# Altium schematic sheet DDR3_PLEIADES.SchDoc
size Tabloid; SheetNumber: 1; SheetTotal: 1; Sheet_Name: Insert name in Document Parameters; Size: 11x17
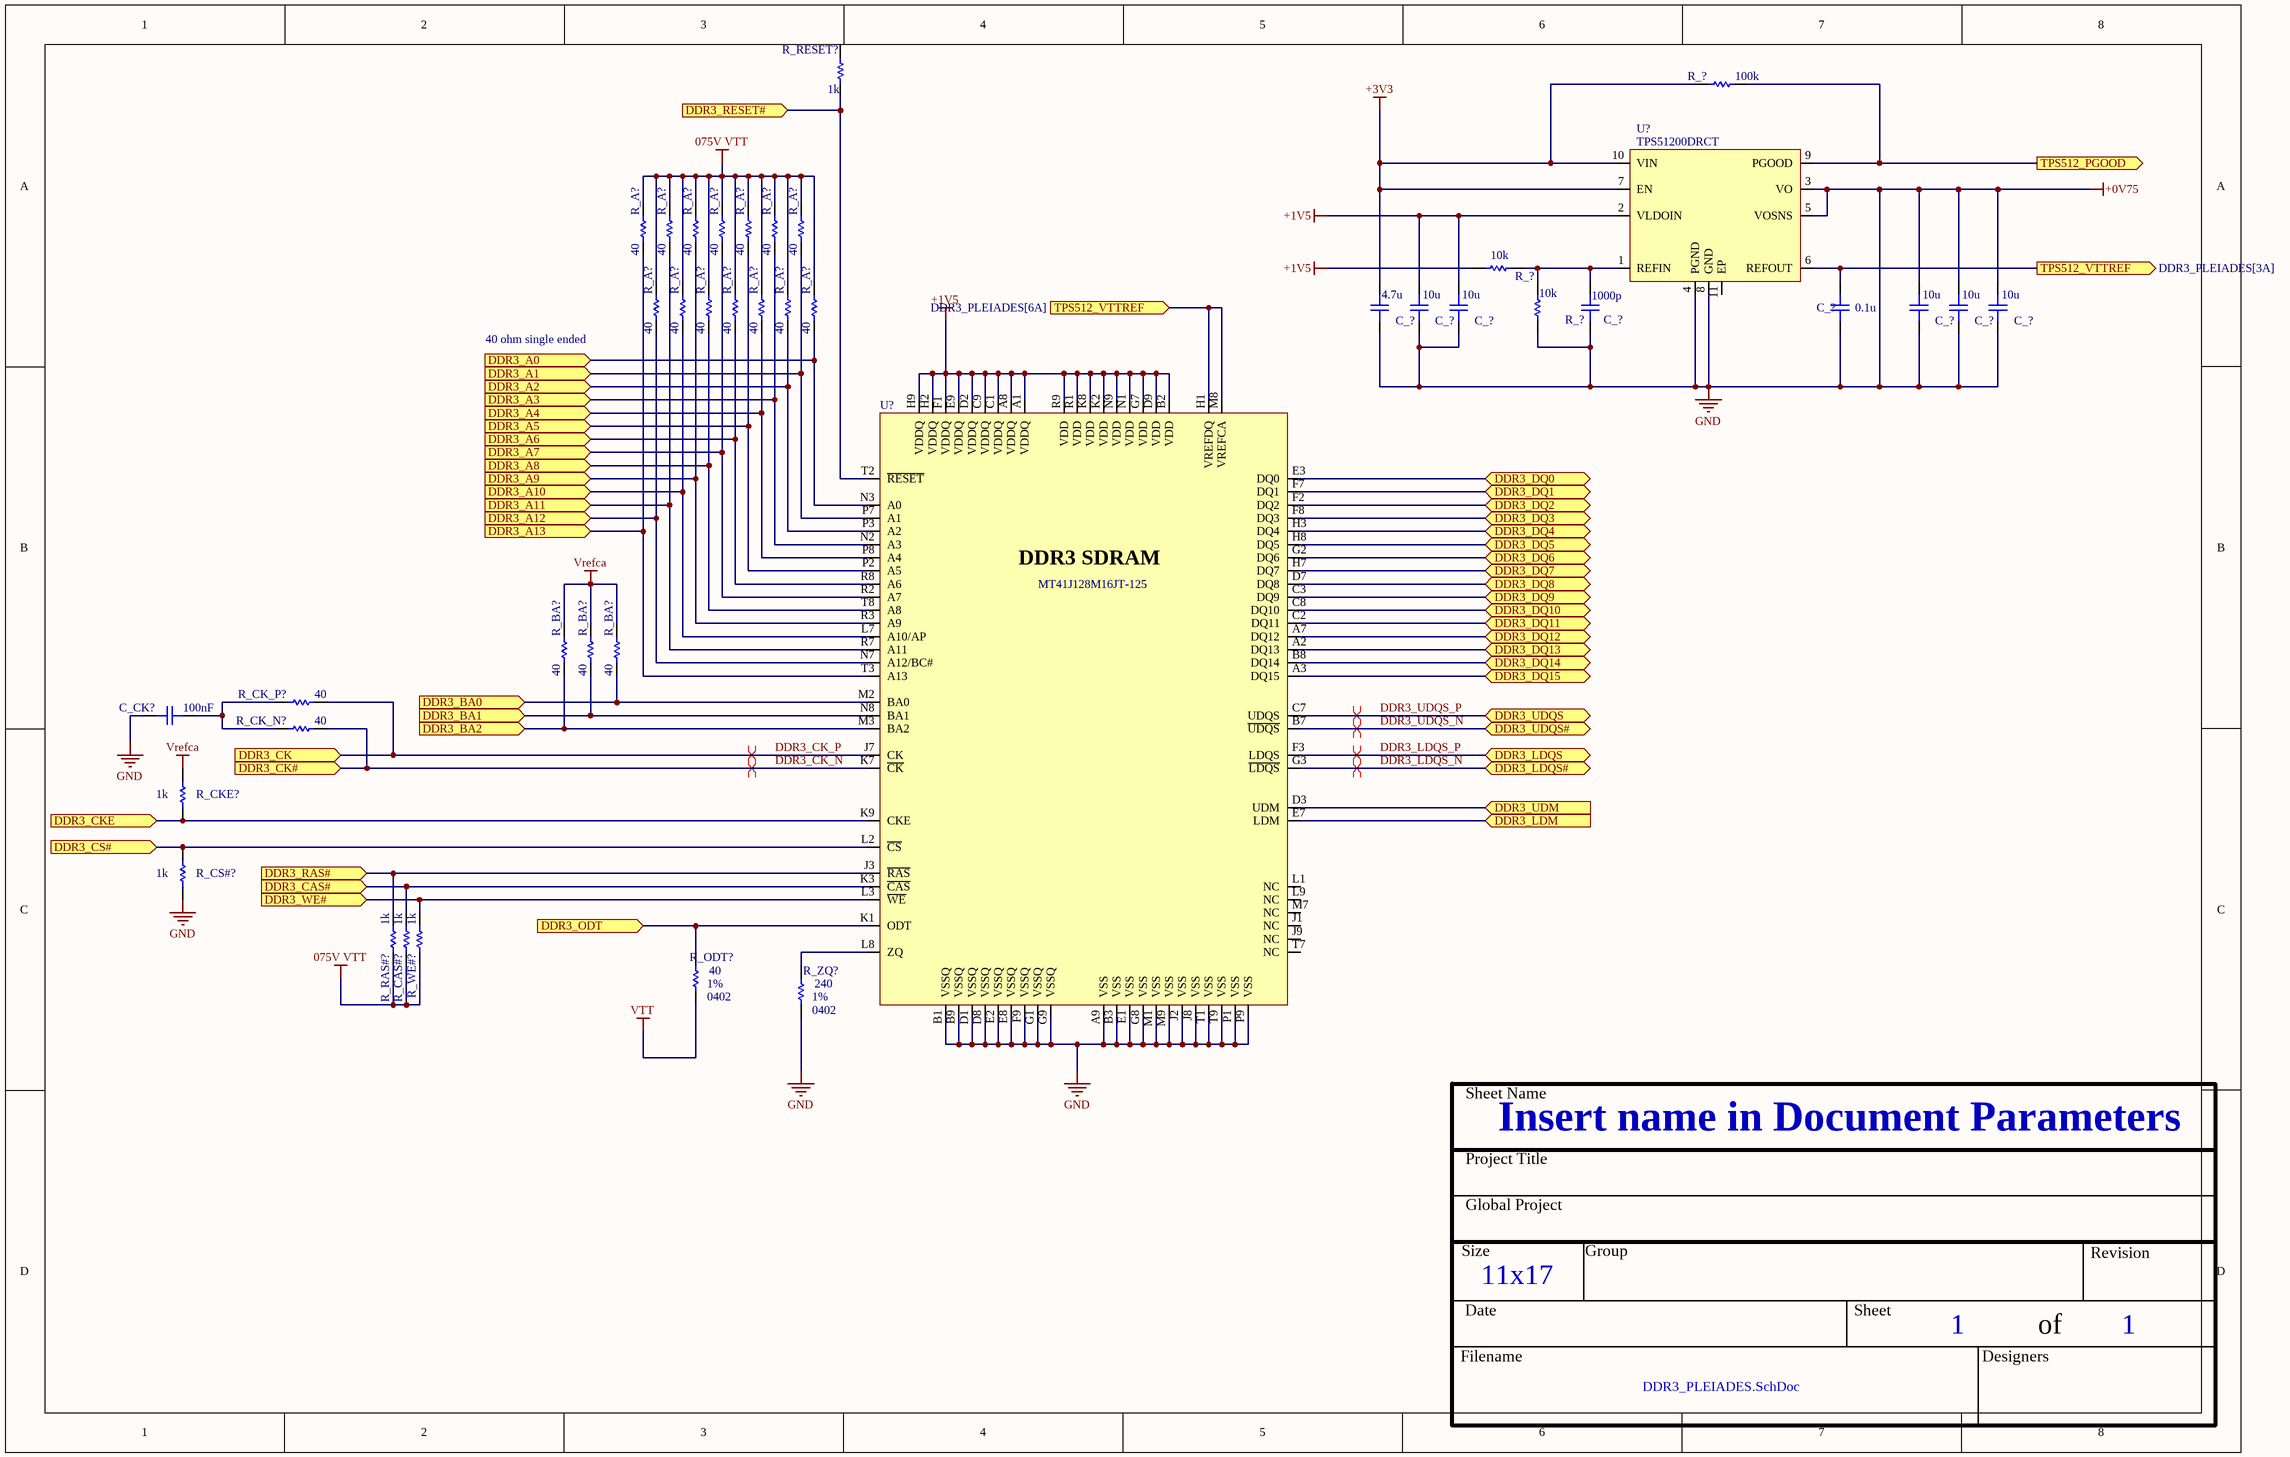
[diagram p0: DDR3_PLEIADES.SchDoc]

## Parts
(Parts that share a designator on the sheet are numbered #1, #2 ... from top to bottom, then left to right.)
C_?#1  value 4.7u  [CAP_0402]  (hidden comment: CAP - 0402)
C_?#2  value 10u  [CAP_0402]  (hidden comment: CAP - 0402)
C_?#3  value 10u  [CAP_0402]  (hidden comment: CAP - 0402)
C_?#4  value 1000p  [CAP_0402]  (hidden comment: CAP - 0402)
C_?#5  value 0.1u  [CAP_0402]  (hidden comment: CAP - 0402)
C_?#6  value 10u  [CAP_0402]  (hidden comment: CAP - 0402)
C_?#7  value 10u  [CAP_0402]  (hidden comment: CAP - 0402)
C_?#8  value 10u  [CAP_0402]  (hidden comment: CAP - 0402)
C_CK?  value 100nF  [CAP_0402]  (hidden comment: CAP - 0402)
R_?#1  value 100k  [RES_0402]  (hidden comment: RES - 0402)
R_?#2  value 10k  [RES_0402]  (hidden comment: RES - 0402)
R_?#3  value 10k  [RES_0402]  (hidden comment: RES - 0402)
R_A?#1  value 40  [RES_0402]  (hidden comment: RES - 0402)
R_A?#2  value 40  [RES_0402]  (hidden comment: RES - 0402)
R_A?#3  value 40  [RES_0402]  (hidden comment: RES - 0402)
R_A?#4  value 40  [RES_0402]  (hidden comment: RES - 0402)
R_A?#5  value 40  [RES_0402]  (hidden comment: RES - 0402)
R_A?#6  value 40  [RES_0402]  (hidden comment: RES - 0402)
R_A?#7  value 40  [RES_0402]  (hidden comment: RES - 0402)
R_A?#8  value 40  [RES_0402]  (hidden comment: RES - 0402)
R_A?#9  value 40  [RES_0402]  (hidden comment: RES - 0402)
R_A?#10  value 40  [RES_0402]  (hidden comment: RES - 0402)
R_A?#11  value 40  [RES_0402]  (hidden comment: RES - 0402)
R_A?#12  value 40  [RES_0402]  (hidden comment: RES - 0402)
R_A?#13  value 40  [RES_0402]  (hidden comment: RES - 0402)
R_A?#14  value 40  [RES_0402]  (hidden comment: RES - 0402)
R_BA?#1  value 40  [RES_0402]  (hidden comment: RES - 0402)
R_BA?#2  value 40  [RES_0402]  (hidden comment: RES - 0402)
R_BA?#3  value 40  [RES_0402]  (hidden comment: RES - 0402)
R_CAS#?  value 1k  [RES_0402]  (hidden comment: RES - 0402)
R_CK_N?  value 40  [RES_0402]  (hidden comment: RES - 0402)
R_CK_P?  value 40  [RES_0402]  (hidden comment: RES - 0402)
R_CKE?  value 1k  [RES_0402]  (hidden comment: RES - 0402)
R_CS#?  value 1k  [RES_0402]  (hidden comment: RES - 0402)
R_ODT?  value 40  Package: 0402  Precision: 1%  [RES_0402]  (hidden comment: RES - 0402)
R_RAS#?  value 1k  [RES_0402]  (hidden comment: RES - 0402)
R_RESET?  value 1k  [RES_0402]  (hidden comment: RES - 0402)
R_WE#?  value 1k  [RES_0402]  (hidden comment: RES - 0402)
R_ZQ?  value 240  Package: 0402  Precision: 1%  [RES_0402]  (hidden comment: RES - 0402)
U?#1  TPS51200DRCT  [REG_PMIC_TPS51200DRCT]
U?#2  MT41J128M16JT-125  [MEM_DDR3_MT41J128M16JT-125]

## Ports
DDR3_A0 (in), DDR3_A1 (in), DDR3_A2 (in), DDR3_A3 (in), DDR3_A4 (in), DDR3_A5 (in), DDR3_A6 (in), DDR3_A7 (in), DDR3_A8 (in), DDR3_A9 (in), DDR3_A10 (in), DDR3_A11 (in), DDR3_A12 (in), DDR3_A13 (in), DDR3_BA0 (in), DDR3_BA1 (in), DDR3_BA2 (in), DDR3_CAS# (in), DDR3_CK (in), DDR3_CK# (in), DDR3_CKE (in), DDR3_CS# (in), DDR3_DQ0 (bidir), DDR3_DQ1 (bidir), DDR3_DQ2 (bidir), DDR3_DQ3 (bidir), DDR3_DQ4 (bidir), DDR3_DQ5 (bidir), DDR3_DQ6 (bidir), DDR3_DQ7 (bidir), DDR3_DQ8 (bidir), DDR3_DQ9 (bidir), DDR3_DQ10 (bidir), DDR3_DQ11 (bidir), DDR3_DQ12 (bidir), DDR3_DQ13 (bidir), DDR3_DQ14 (bidir), DDR3_DQ15 (bidir), DDR3_LDM (in), DDR3_LDQS (bidir), DDR3_LDQS# (bidir), DDR3_ODT (in), DDR3_RAS# (in), DDR3_RESET# (in), DDR3_UDM (in), DDR3_UDQS (bidir), DDR3_UDQS# (bidir), DDR3_WE# (in), TPS512_PGOOD (out), TPS512_VTTREF (in, see DDR3_PLEIADES[6A]), TPS512_VTTREF (out, see DDR3_PLEIADES[3A])

## Nets
075V VTT: R_A?#1.2 R_A?#2.2 R_A?#3.2 R_A?#4.2 R_A?#5.2 R_A?#6.2 R_A?#7.2 R_A?#8.2 R_A?#9.2 R_A?#10.2 R_A?#11.2 R_A?#12.2 R_A?#13.2 R_A?#14.2 R_CAS#?.2 R_RAS#?.2 R_WE#?.2
+0V75: C_?#1.2 C_?#2.2 C_?#3.2 C_?#4.2 C_?#5.2 C_?#6.1 C_?#6.2 C_?#7.1 C_?#7.2 C_?#8.1 C_?#8.2 C_CK?.2 R_?#3.1 R_CS#?.1 R_ZQ?.1 U?#1.3(VO) U?#1.4(PGND) U?#1.5(VOSNS) U?#1.8(GND) U?#2.A9(VSS) U?#2.B1(VSSQ) U?#2.B3(VSS) U?#2.B9(VSSQ) U?#2.D1(VSSQ) U?#2.D8(VSSQ) U?#2.E1(VSS) U?#2.E2(VSSQ) U?#2.E8(VSSQ) U?#2.F9(VSSQ) U?#2.G1(VSSQ) U?#2.G8(VSS) U?#2.G9(VSSQ) U?#2.J2(VSS) U?#2.J8(VSS) U?#2.M1(VSS) U?#2.M9(VSS) U?#2.P1(VSS) U?#2.P9(VSS) U?#2.T1(VSS) U?#2.T9(VSS)  [also labelled GND]
+1V5: C_?#2.1 C_?#3.1 R_?#2.1 U?#1.2(VLDOIN) U?#2.A1(VDDQ) U?#2.A8(VDDQ) U?#2.B2(VDD) U?#2.C1(VDDQ) U?#2.C9(VDDQ) U?#2.D2(VDDQ) U?#2.D9(VDD) U?#2.E9(VDDQ) U?#2.F1(VDDQ) U?#2.G7(VDD) U?#2.H2(VDDQ) U?#2.H9(VDDQ) U?#2.K2(VDD) U?#2.K8(VDD) U?#2.N1(VDD) U?#2.N9(VDD) U?#2.R1(VDD) U?#2.R9(VDD)
+3V3: C_?#1.1 R_?#1.1 U?#1.7(EN) U?#1.10(VIN)
Vrefca: R_BA?#1.2 R_BA?#2.2 R_BA?#3.2 R_CKE?.1
VTT: R_ODT?.1
DDR3_A0: R_A?#14.1 U?#2.N3(A0) ; port DDR3_A0
DDR3_A1: R_A?#7.1 U?#2.P7(A1) ; port DDR3_A1
DDR3_A2: R_A?#13.1 U?#2.P3(A2) ; port DDR3_A2
DDR3_A3: R_A?#6.1 U?#2.N2(A3) ; port DDR3_A3
DDR3_A4: R_A?#12.1 U?#2.P8(A4) ; port DDR3_A4
DDR3_A5: R_A?#5.1 U?#2.P2(A5) ; port DDR3_A5
DDR3_A6: R_A?#11.1 U?#2.R8(A6) ; port DDR3_A6
DDR3_A7: R_A?#4.1 U?#2.R2(A7) ; port DDR3_A7
DDR3_A8: R_A?#10.1 U?#2.T8(A8) ; port DDR3_A8
DDR3_A9: R_A?#3.1 U?#2.R3(A9) ; port DDR3_A9
DDR3_A10: R_A?#9.1 U?#2.L7(A10/AP) ; port DDR3_A10
DDR3_A11: R_A?#2.1 U?#2.R7(A11) ; port DDR3_A11
DDR3_A12: R_A?#8.1 U?#2.N7(A12/BC#) ; port DDR3_A12
DDR3_A13: R_A?#1.1 U?#2.T3(A13) ; port DDR3_A13
DDR3_BA0: R_BA?#3.1 U?#2.M2(BA0) ; port DDR3_BA0
DDR3_BA1: R_BA?#2.1 U?#2.N8(BA1) ; port DDR3_BA1
DDR3_BA2: R_BA?#1.1 U?#2.M3(BA2) ; port DDR3_BA2
DDR3_CAS#: R_CAS#?.1 U?#2.K3(~{CAS}) ; port DDR3_CAS#
DDR3_CK_N: R_CK_N?.2 U?#2.K7(~{CK}) ; port DDR3_CK#
DDR3_CK_P: R_CK_P?.2 U?#2.J7(CK) ; port DDR3_CK
DDR3_CKE: R_CKE?.2 U?#2.K9(CKE) ; port DDR3_CKE
DDR3_CS#: R_CS#?.2 U?#2.L2(~{CS}) ; port DDR3_CS#
DDR3_DQ0: U?#2.E3(DQ0) ; port DDR3_DQ0
DDR3_DQ1: U?#2.F7(DQ1) ; port DDR3_DQ1
DDR3_DQ2: U?#2.F2(DQ2) ; port DDR3_DQ2
DDR3_DQ3: U?#2.F8(DQ3) ; port DDR3_DQ3
DDR3_DQ4: U?#2.H3(DQ4) ; port DDR3_DQ4
DDR3_DQ5: U?#2.H8(DQ5) ; port DDR3_DQ5
DDR3_DQ6: U?#2.G2(DQ6) ; port DDR3_DQ6
DDR3_DQ7: U?#2.H7(DQ7) ; port DDR3_DQ7
DDR3_DQ8: U?#2.D7(DQ8) ; port DDR3_DQ8
DDR3_DQ9: U?#2.C3(DQ9) ; port DDR3_DQ9
DDR3_DQ10: U?#2.C8(DQ10) ; port DDR3_DQ10
DDR3_DQ11: U?#2.C2(DQ11) ; port DDR3_DQ11
DDR3_DQ12: U?#2.A7(DQ12) ; port DDR3_DQ12
DDR3_DQ13: U?#2.A2(DQ13) ; port DDR3_DQ13
DDR3_DQ14: U?#2.B8(DQ14) ; port DDR3_DQ14
DDR3_DQ15: U?#2.A3(DQ15) ; port DDR3_DQ15
DDR3_LDM: U?#2.E7(LDM) ; port DDR3_LDM
DDR3_LDQS_N: U?#2.G3(~{LDQS}) ; port DDR3_LDQS#
DDR3_LDQS_P: U?#2.F3(LDQS) ; port DDR3_LDQS
DDR3_ODT: R_ODT?.2 U?#2.K1(ODT) ; port DDR3_ODT
DDR3_RAS#: R_RAS#?.1 U?#2.J3(~{RAS}) ; port DDR3_RAS#
DDR3_RESET#: R_RESET?.1 U?#2.T2(~{RESET}) ; port DDR3_RESET#
DDR3_UDM: U?#2.D3(UDM) ; port DDR3_UDM
DDR3_UDQS_N: U?#2.B7(~{UDQS}) ; port DDR3_UDQS#
DDR3_UDQS_P: U?#2.C7(UDQS) ; port DDR3_UDQS
DDR3_WE#: R_WE#?.1 U?#2.L3(~{WE}) ; port DDR3_WE#
TPS512_PGOOD: R_?#1.2 U?#1.9(PGOOD) ; port TPS512_PGOOD
TPS512_VTTREF: C_?#5.1 U?#1.6(REFOUT) U?#2.H1(VREFDQ) U?#2.M8(VREFCA) ; port TPS512_VTTREF
NetC_?#4_1: C_?#4.1 R_?#2.2 R_?#3.2 U?#1.1(REFIN)
NetC_CK?_1: C_CK?.1 R_CK_N?.1 R_CK_P?.1
NetR_ZQ?_2: R_ZQ?.2 U?#2.L8(ZQ)

Not connected (* = marked no-connect by the designer): R_RESET? 2; U?#1 11(EP); U?#2 J1(NC) J9(NC) L1(NC) L9(NC) M7(NC) T7(NC)

## Layout directives
differential pair: DDR3_CK_N, DDR3_CK_P, DDR3_LDQS_N, DDR3_LDQS_P, DDR3_UDQS_N, DDR3_UDQS_P

## Notes on the sheet
- 40 ohm single ended
- Sheet Name
- Project Title
- Global Project
- Size
- Group
- Revision
- Date
- Sheet
- of
- Filename
- Designers
- (in symbol MEM_DDR3_MT41J128M16JT-125:K TR) DDR3 SDRAM

## Library data of the parts
C_?#1-C_?#8 C_CK? = CAP - 0402: Precision: 10%; Voltage: 50V; Current: *; CreatedBy: Jonathan Bouchard; Power: *; Package: 0402
R_?#1-R_?#3 R_A?#1-R_A?#14 R_BA?#1-R_BA?#3 R_CAS#? R_CK_N? R_CK_P? R_CKE? R_CS#? R_RAS#? R_RESET? R_WE#? = RES - 0402: Voltage: 50V; Power: 1/16W; Precision: 1%; Current: *; CreatedBy: Jonathan Bouchard; Package: 0402
R_ODT? R_ZQ? = RES - 0402: Voltage: 50V; Power: 1/16W; Current: *; CreatedBy: Jonathan Bouchard
U?#1 = REG_PMIC_TPS51200DRCT: REG - DDR TERMINATION/REF REG - 10-VFDFN; Manufacturer #1: Texas Instruments; Value: DDR, DDR2, DDR3(L), DDR4; Voltage Rating: 2.375V ~ 3.5V; Current Rating: Source: 3A~4.5A, Sink: 3.5A~5.5A; GRAMS Lib Spec: 2.8; Magnetic Material: Unknown; Polarized: Yes; Tolerance: *; Power Max: *; HelpURL: http://www.ti.com/lit/ds/symlink/tps51200.pdf; CreatedBy/Date: Joel Lemay 2019-03-19; VerifiedBy: Nicolas V. (2019-05-31); Temperature: -40°C ~ 85°C; Package: 10-VFDFN; Manufacturer #2: *; Note: *; Assembly Type: SMD; Part Number #2: *; Part Number #1: TPS51200DRCT; Supplier 1: Digi-Key; Supplier Part Number 1: 296-23830-1-ND; Cryo: UNKNOWN
U?#2 = MEM_DDR3_MT41J128M16JT-125:K TR: MEM - DDR3 SDRAM 2GBIT 800MHZ - TFBGA-96; Voltage: 1.425 V ~ 1.575 V; Mfg: Micrel; Current: *; Power: *; Mfg Part Number: MT41J128M16JT-125; HelpURL: http://www.micron.com/~/media/Documents/Products/Data%20Sheet/DRAM/DDR3/2Gb_DDR3_SDRAM.pdf; CreatedBy: Jonathan Bouchard; Temperature: 0°C ~ 95°C (TC); Value: *; Precision: *; Package: TFBGA-96; Supplier 1: Digikey; Supplier Part Number 1: 557-1611-1-ND